# Altium schematic sheet USB2.0&USB3.0.SchDoc
size 594 x 420 mm
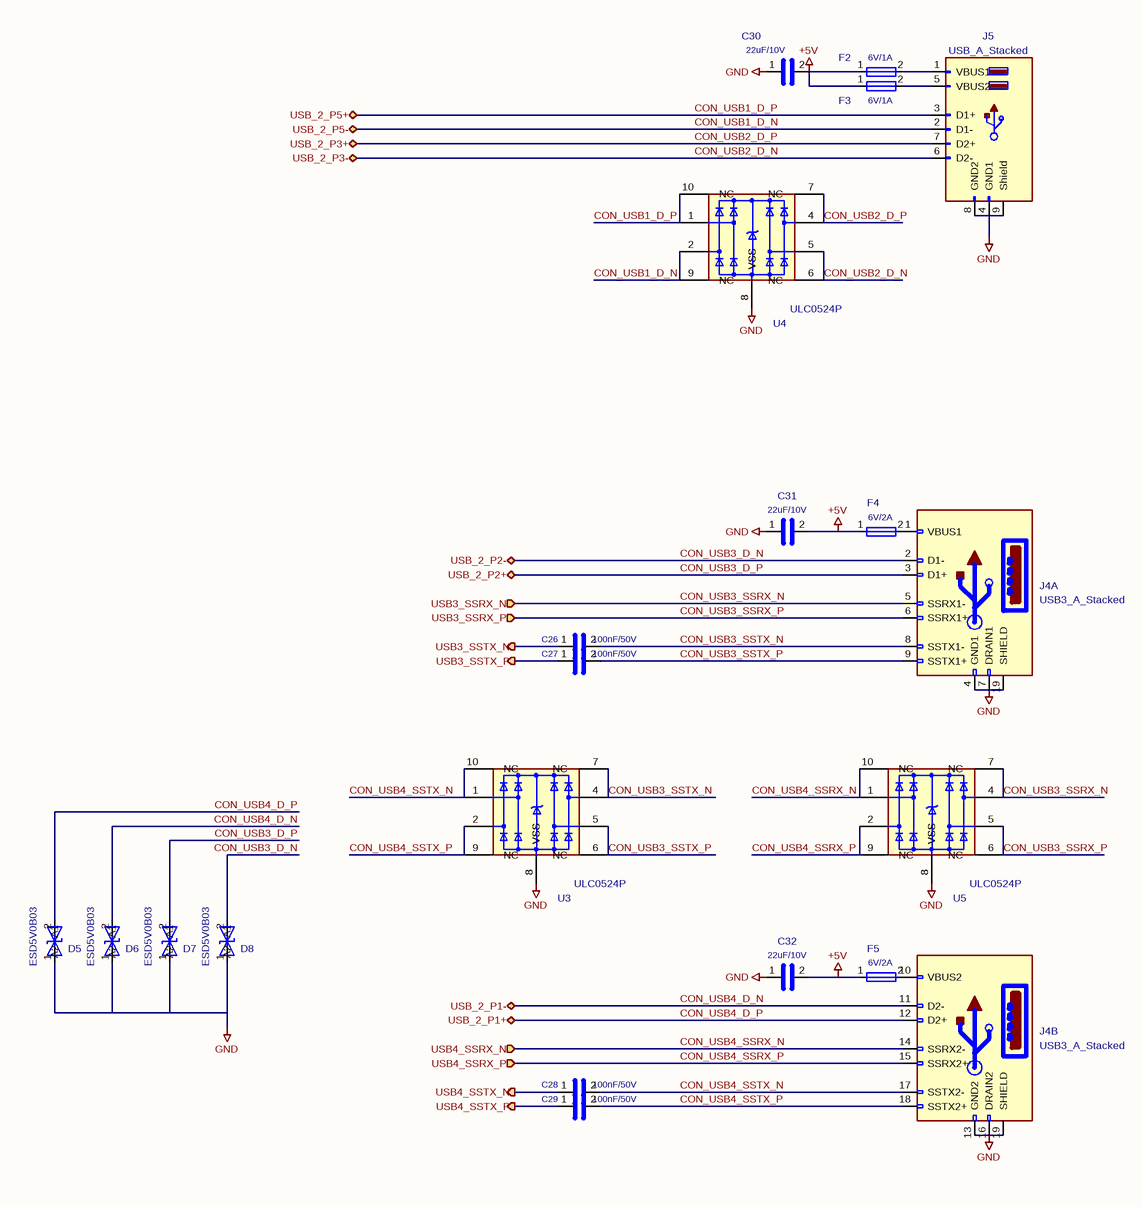
[diagram p0: USB2.0&USB3.0.SchDoc]

## Parts
C26  100nF/50V  [C_0402_1005Metric]
C27  100nF/50V  [C_0402_1005Metric]
C28  100nF/50V  [C_0402_1005Metric]
C29  100nF/50V  [C_0402_1005Metric]
C30  22uF/10V  [C_0603_1608Metric]
C31  22uF/10V  [C_0603_1608Metric]
C32  22uF/10V  [C_0603_1608Metric]
D5  ESD5V0B03  [D_0402_1005Metric]
D6  ESD5V0B03  [D_0402_1005Metric]
D7  ESD5V0B03  [D_0402_1005Metric]
D8  ESD5V0B03  [D_0402_1005Metric]
F2  6V/1A  [Fuse_0805_2012Metric]
F3  6V/1A  [Fuse_0805_2012Metric]
F4  6V/2A  [R_0805_2012Metric]
F5  6V/2A  [Fuse_0805_2012Metric]
J4  USB3_A_Stacked  [USB3_A_Molex_48406-0001_Horizontal_Stacked]  (parts A,B of 2)
J5  USB_A_Stacked  [USB_A_CUI_UJ2-ADH-TH_Horizontal_Stacked]
U3  ULC0524P  [Diodes_UDFN-10_1.0x2.5mm_P0.5mm]
U4  ULC0524P  [Diodes_UDFN-10_1.0x2.5mm_P0.5mm]
U5  ULC0524P  [Diodes_UDFN-10_1.0x2.5mm_P0.5mm]

## Ports
USB3_SSRX_N (in), USB3_SSRX_P (in), USB3_SSTX_N (out), USB3_SSTX_P (out), USB4_SSRX_N (in), USB4_SSRX_P (in), USB4_SSTX_N (out), USB4_SSTX_P (out), USB_2_P1+ (bidir), USB_2_P1- (bidir), USB_2_P2+ (bidir), USB_2_P2- (bidir), USB_2_P3+ (bidir), USB_2_P3- (bidir), USB_2_P5+ (bidir), USB_2_P5- (bidir)

## Nets
+5V: C30.2 C31.2 C32.2 F2.1 F3.1 F4.1 F5.1
GND: C30.1 C31.1 C32.1 D5.1(A1) D6.1(A1) D7.1(A1) D8.1(A1) J4.4(GND1) J4.7(DRAIN1) J4.13(GND2) J4.16(DRAIN2) J4.19(SHIELD) J5.4(GND1) J5.8(GND2) J5.9(Shield) U3.3(VSS) U3.8(VSS) U4.3(VSS) U4.8(VSS) U5.3(VSS) U5.8(VSS)
CON_USB1_D_N: J5.2(D1-) U4.2 U4.9(NC) ; port USB_2_P5-
CON_USB1_D_P: J5.3(D1+) U4.1 U4.10(NC) ; port USB_2_P5+
CON_USB2_D_N: J5.6(D2-) U4.5 U4.6(NC) ; port USB_2_P3-
CON_USB2_D_P: J5.7(D2+) U4.4 U4.7(NC) ; port USB_2_P3+
CON_USB3_D_N: D8.2(A2) J4.2(D1-) ; port USB_2_P2-
CON_USB3_D_P: D7.2(A2) J4.3(D1+) ; port USB_2_P2+
CON_USB3_SSRX_N: J4.5(SSRX1-) U5.4 U5.7(NC) ; port USB3_SSRX_N
CON_USB3_SSRX_P: J4.6(SSRX1+) U5.5 U5.6(NC) ; port USB3_SSRX_P
CON_USB3_SSTX_N: C26.2 J4.8(SSTX1-) U3.4 U3.7(NC)
CON_USB3_SSTX_P: C27.2 J4.9(SSTX1+) U3.5 U3.6(NC)
CON_USB4_D_N: D6.2(A2) J4.11(D2-) ; port USB_2_P1-
CON_USB4_D_P: D5.2(A2) J4.12(D2+) ; port USB_2_P1+
CON_USB4_SSRX_N: J4.14(SSRX2-) U5.1 U5.10(NC) ; port USB4_SSRX_N
CON_USB4_SSRX_P: J4.15(SSRX2+) U5.2 U5.9(NC) ; port USB4_SSRX_P
CON_USB4_SSTX_N: C28.2 J4.17(SSTX2-) U3.1 U3.10(NC)
CON_USB4_SSTX_P: C29.2 J4.18(SSTX2+) U3.2 U3.9(NC)
USB3_SSTX_N: C26.1 ; port USB3_SSTX_N
USB3_SSTX_P: C27.1 ; port USB3_SSTX_P
USB4_SSTX_N: C28.1 ; port USB4_SSTX_N
USB4_SSTX_P: C29.1 ; port USB4_SSTX_P
NetF2_2: F2.2 J5.1(VBUS1)
NetF3_2: F3.2 J5.5(VBUS2)
NetF4_2: F4.2 J4.1(VBUS1)
NetF5_2: F5.2 J4.10(VBUS2)

## Notes on the sheet
- 1
- 2
- 3
- 4
- 5
- 6
- 7
- 8
- 9
- 10
- 11
- A
- B
- C
- D
- E
- F
- G
- H
- Title: Primer Carrier for LattePanda Mu
- File: USB2.0&USB3.0.kicad_sch
- Sheet: /
- DFRobot
- KiCad E.D.A.  kicad (5.1.4)-1
- Size: A2
- Date: 2024-03-13
- Rev: V1.0.0
- Id: 1/1

## Library data of the parts
C26-C29 = C: SCH_Show_Footprint: C0402; Value: 100nF/50V; Footprint: A_HDJ_Library:C_0402_1005Metric
C30-C32 = C: SCH_Show_Footprint: C603; Value: 22uF/10V; Footprint: A_HDJ_Library:C_0603_1608Metric
D5-D8 = ESD9B5.0ST5G: SCH_Show_Footprint: D0402; Value: ESD5V0B03; Footprint: A_HDJ_Library:D_0402_1005Metric
F2 F3 = Fuse: SCH_Show_Footprint: R0603; Value: 6V/1A; Footprint: A_HDJ_Library:Fuse_0805_2012Metric
F4 F5 = Fuse: SCH_Show_Footprint: R0805; Value: 6V/2A
  F4: Footprint: A_HDJ_Library:R_0805_2012Metric
  F5: Footprint: A_HDJ_Library:Fuse_0805_2012Metric
U3-U5 = D3V3XA4B10LP: Value: ULC0524P; Footprint: A_HDJ_Library:Diodes_UDFN-10_1.0x2.5mm_P0.5mm
J4 = USB3_A_Stacked: Value: USB3_A_Stacked; Footprint: A_HDJ_Library:USB3_A_Molex_48406-0001_Horizontal_Stacked
J5 = USB_A_Stacked: Value: USB_A_Stacked; Footprint: A_HDJ_Library:USB_A_CUI_UJ2-ADH-TH_Horizontal_Stacked